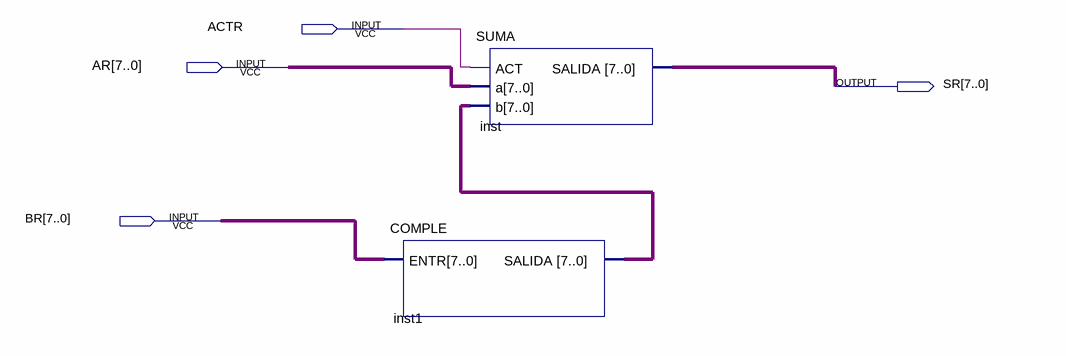
[diagram p0: schematic sheet]
// Quartus schematic RESTA.bdf as structural Verilog: 2 symbols, 4 pins
module RESTA (
  input  ACTR,
  input  [7:0] AR,
  input  [7:0] BR,
  output [7:0] SR
);

  wire [7:0] inst1_salida;

  COMPLE inst1 (.ENTR(BR), .SALIDA(inst1_salida));
  SUMA inst (.ACT(ACTR), .a(AR), .b(inst1_salida), .SALIDA(SR));
endmodule
